# EAGLE design ELN-P Shield (EAGLE 5.06)
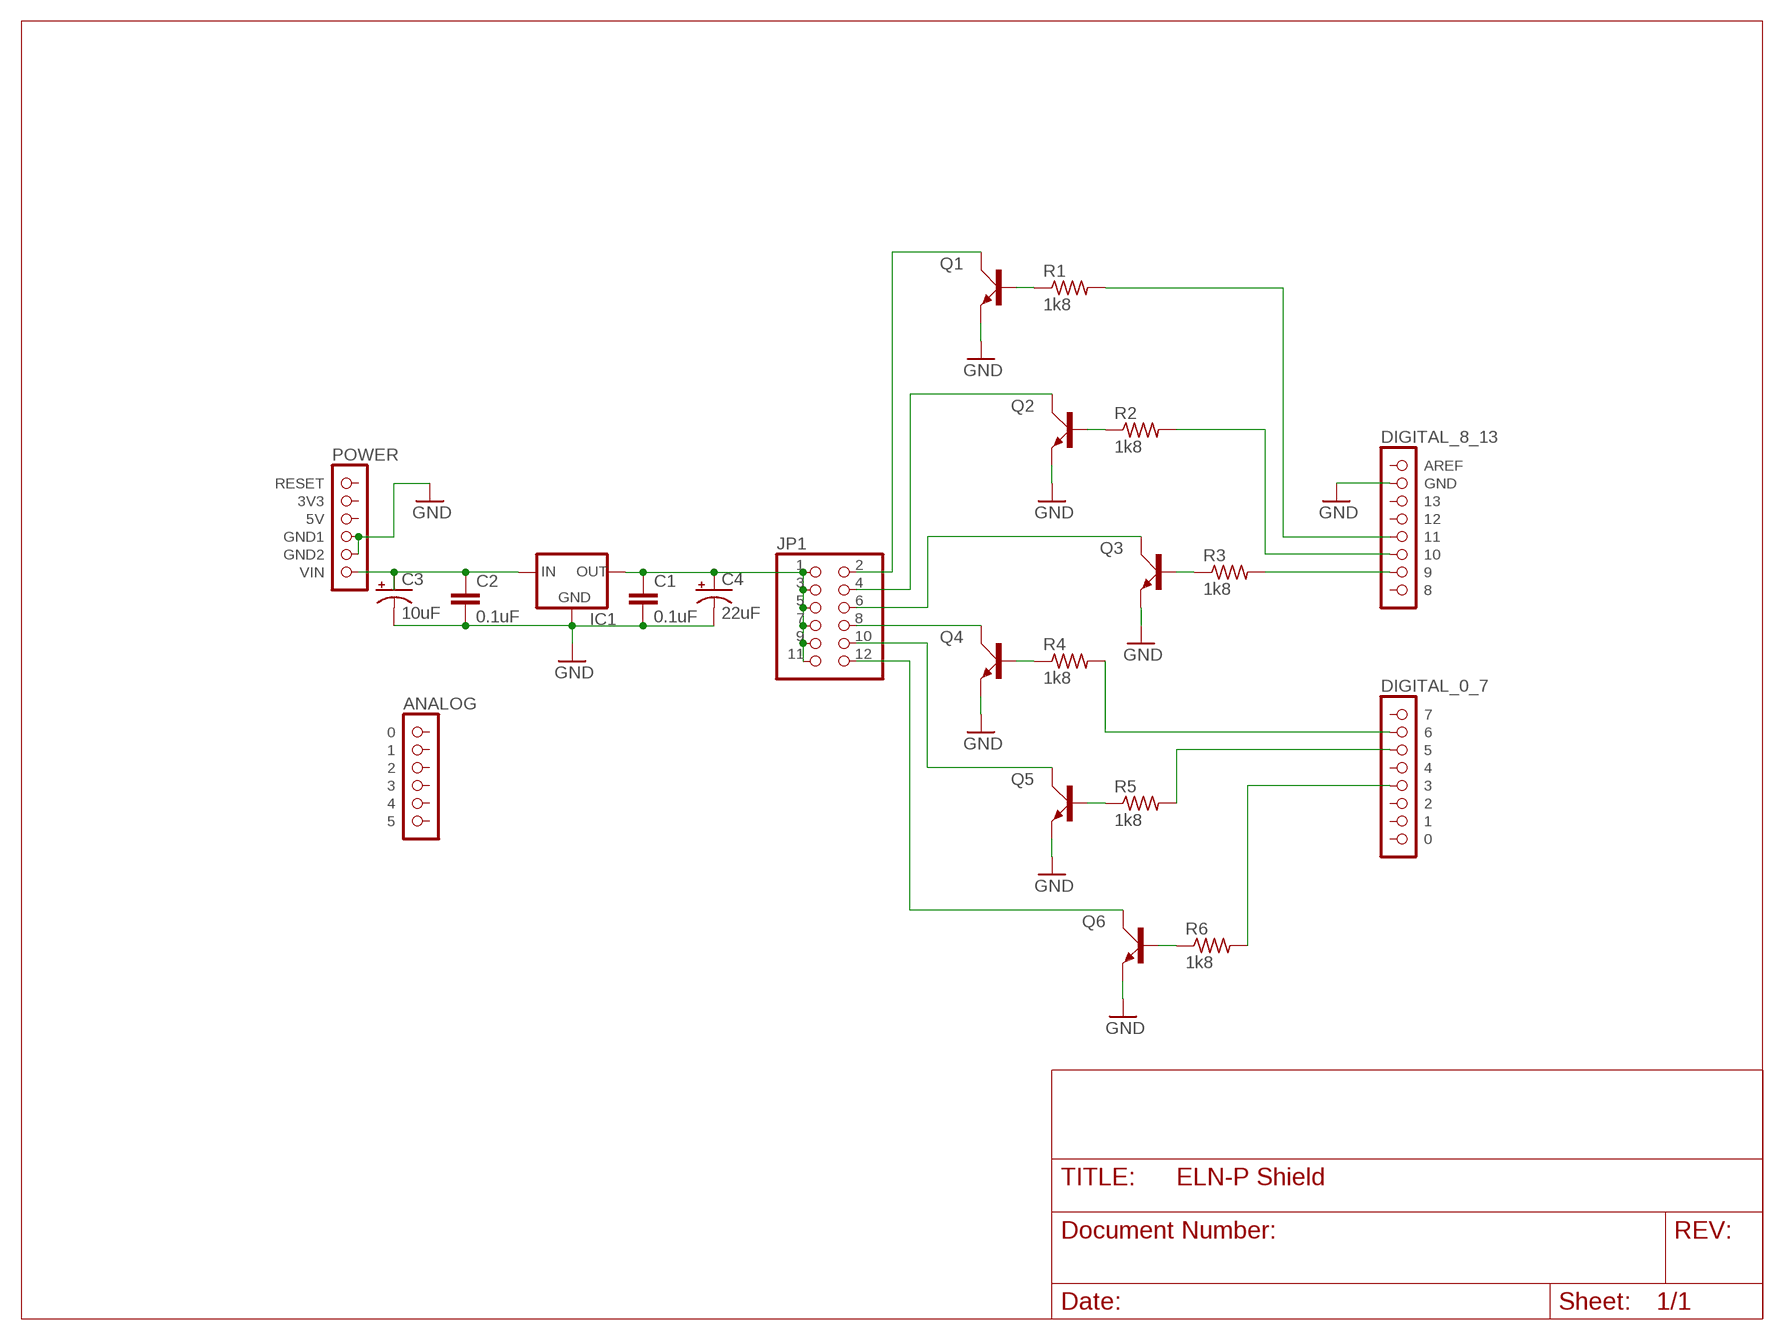
[diagram p0: schematic, sheet 1]

## Parts
C1  0.1uF  CAP1206  [C1206]
C2  0.1uF  CAP1206  [C1206]
C3  10uF  CAP_POL5MM  [NICHICON5]
C4  22uF  CAP_POL6.3MM  [NICHICON6.3]
IC1  L4940  [D2PAK_ST]
JP1  PINHD-2X6  [2X06]
Q1  BC846SOT23  [SOT23]
Q2  BC846SOT23  [SOT23]
Q3  BC846SOT23  [SOT23]
Q4  BC846SOT23  [SOT23]
Q5  BC846SOT23  [SOT23]
Q6  BC846SOT23  [SOT23]
R1  1k8  R-US_R1206  [R1206]
R2  1k8  R-US_R1206  [R1206]
R3  1k8  R-US_R1206  [R1206]
R4  1k8  R-US_R1206  [R1206]
R5  1k8  R-US_R1206  [R1206]
R6  1k8  R-US_R1206  [R1206]
U$1  POWER  [1X06]
U$2  ANALOG  [1X06]
U$3  DIGITAL_0_7  [1X08]
U$4  DIGITAL_8_13  [1X08]

## Nets
GND [Power]: C1.2 C2.2 C3.- C4.- IC1.P$3(GND) Q1.2(E) Q2.2(E) Q3.2(E) Q4.2(E) Q5.2(E) Q6.2(E) U$1.4(GND1) U$1.5(GND2) U$4.2(GND)
N$1: Q1.1(B) R1.1
N$2: JP1.2 Q1.3(C)
N$3 [Power]: C1.1 C4.+ IC1.P$2(OUT) JP1.1 JP1.3 JP1.5 JP1.7 JP1.9 JP1.11
N$4: R1.2 U$4.5
N$5: R6.2 U$3.5
N$6: R5.2 U$3.3
N$7: R4.2 U$3.2
N$8: R3.2 U$4.7
N$9: R2.2 U$4.6
N$10: Q2.1(B) R2.1
N$11: Q3.1(B) R3.1
N$12: JP1.6 Q3.3(C)
N$13: JP1.4 Q2.3(C)
N$14: Q4.1(B) R4.1
N$15: JP1.8 Q4.3(C)
N$16: Q6.1(B) R6.1
N$17: Q5.1(B) R5.1
N$18: JP1.10 Q5.3(C)
N$19: JP1.12 Q6.3(C)
VIN [Power]: C2.1 C3.+ IC1.P$1(IN) U$1.6(VIN)
Unconnected: U$1.1(RESET) U$1.2(3V3) U$1.3(5V) U$2.1 U$2.2 U$2.3 U$2.4 U$2.5 U$2.6 U$3.1 U$3.4 U$3.6 U$3.7 U$3.8 U$4.1(AREF) U$4.3 U$4.4 U$4.8

## Library data of the parts
C1 C2 = _allyourbase:CAP: Capacitor Standard 0603 ceramic capacitor, and 0.1" leaded capacitor.
C3 C4 = _allyourbase:CAP_POL: Capacitor Polarized These are standard SMD and PTH capacitors. Normally 10uF, 47uF, and 100uF in electrolytic and tantalum varieties. Always verify the external diameter of the through hole cap, it varies with capacity, voltage, and manufacturer. The EIA devices should be standard.
IC1 = _allyourbase:L4940
JP1 = pinhead:PINHD-2X6: PIN HEADER
Q1-Q6 = _allyourbase:BC846: NPN TRANSISTOR
R1-R6 = _allyourbase:R-US_: RESISTOR, American symbol
U$1 = arduino:POWER
U$2 = arduino:ANALOG
U$3 = arduino:DIGITAL_0_7
U$4 = arduino:DIGITAL_8_13

## Net classes
0 default: width 0.305 mm, drill 0.508 mm
1 Power: width 0.406 mm, drill 0.508 mm

## Board
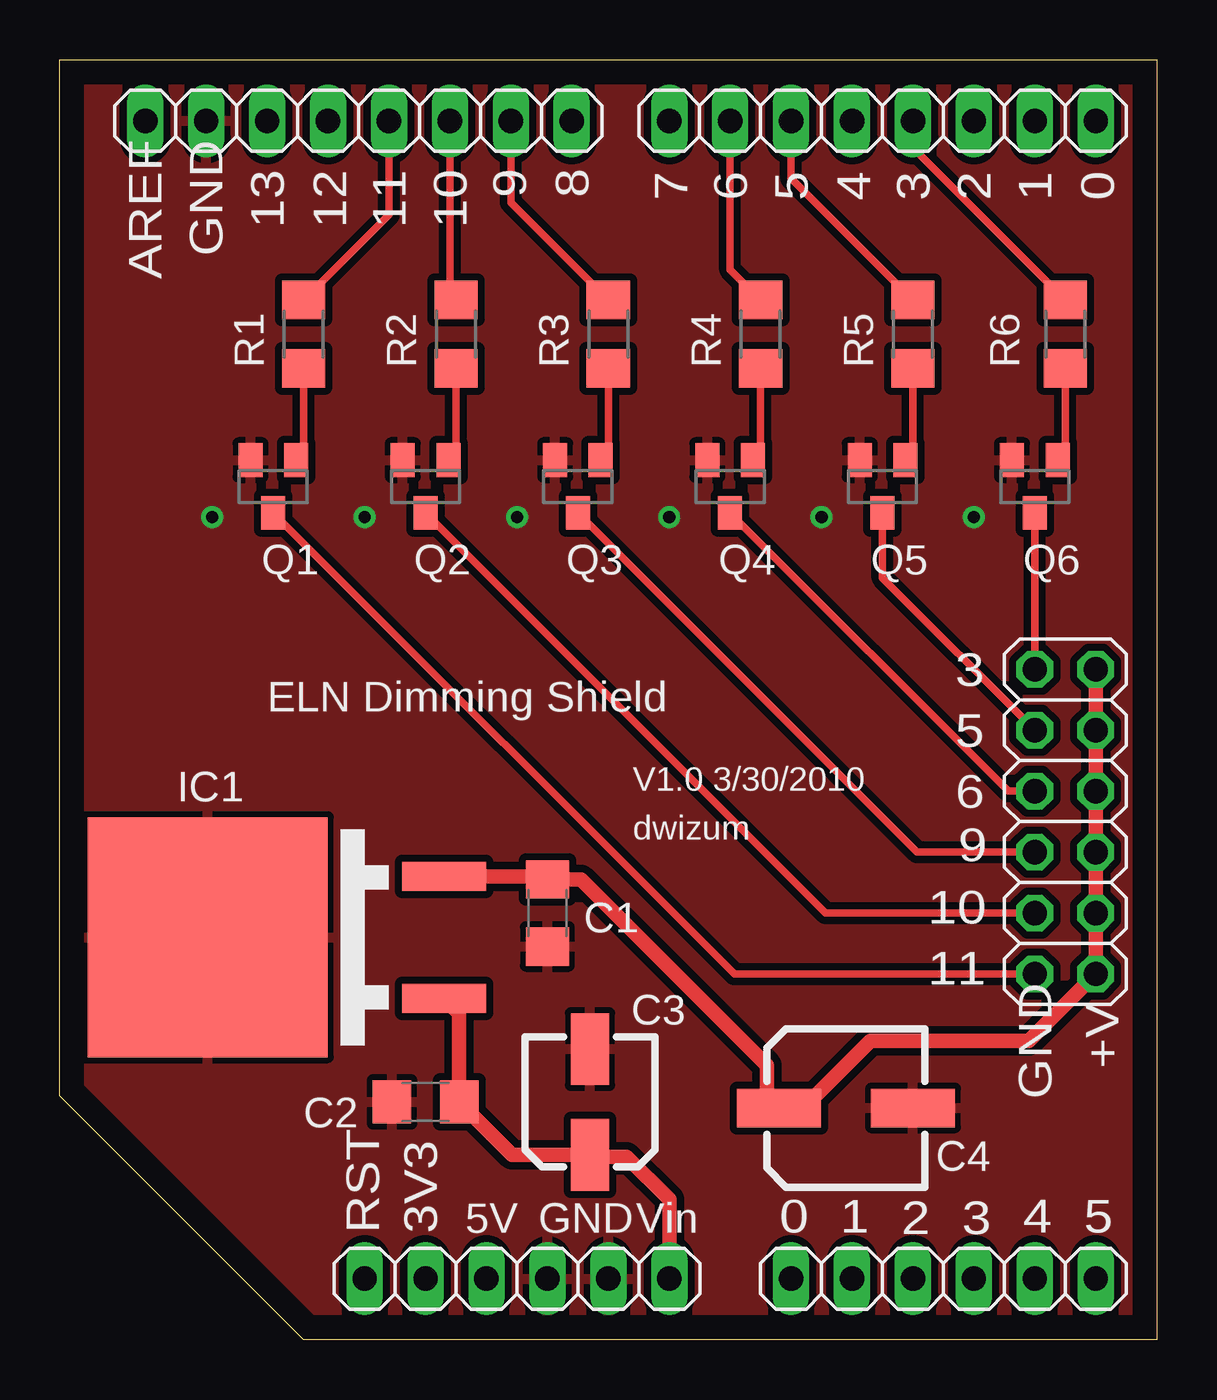
[diagram p1: board, top side]
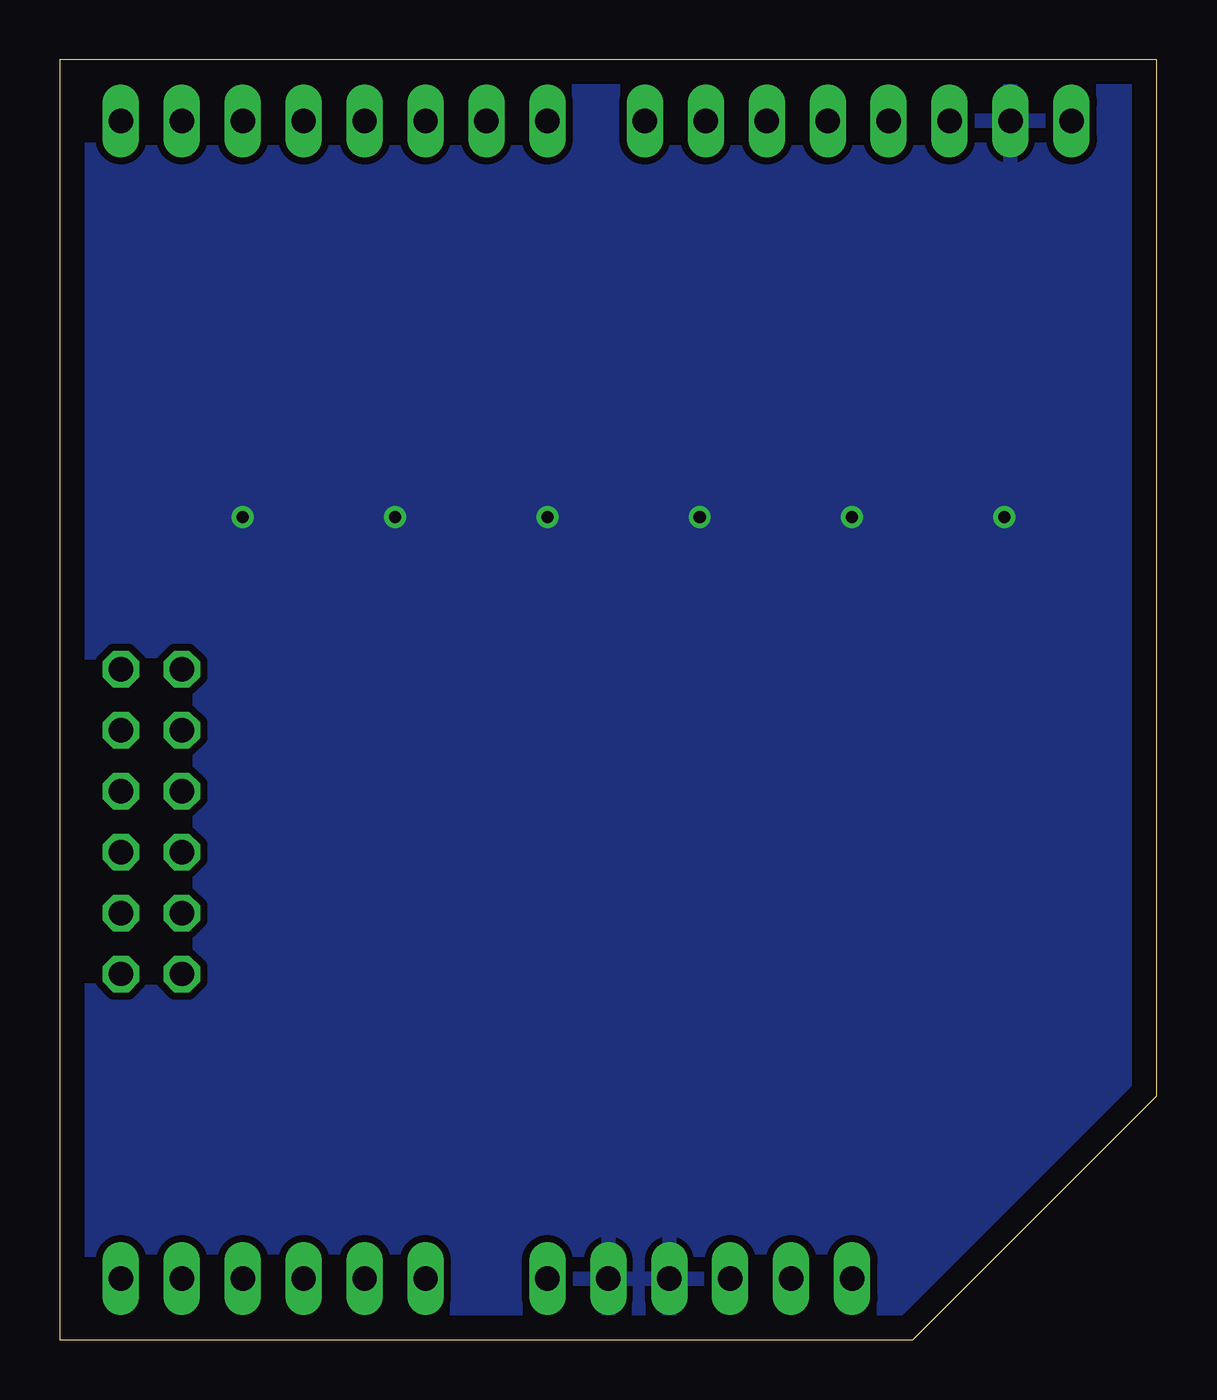
[diagram p2: board, bottom side, seen from below]

Size 45.72 x 53.34 mm. Coordinates in mm from the lower left corner, seen from the top.
Outline: 0,53.34 45.72,53.34 45.72,0 10.16,0 0,10.16 0,53.34
Copper layers (1*16): Top 0.035mm / dielectric 1.5mm / Bottom 0.035mm
Design rules "default *": minimum track width 10mil, minimum drill 20mil, track to track 8mil, track to pad 8mil, pad to pad 8mil, via to via 8mil, smd to smd 8mil, copper to edge 40mil, drill to drill 8mil, minimum pad ring 10mil, minimum via ring 8mil, stop-mask expansion 4mil, vias tented up to drill 0mil, thermal gap 10mil

### Footprints (pad centres in the part's own frame; a part is rotated, then mirrored left to right if it is on the bottom)
C1206 = smd 1.6 x 1.8: 1 -1.4,0; 2 1.4,0
NICHICON5 = smd 3 x 1.6: + 2.2,0; - -2.2,0
NICHICON6.3 = smd 3.5 x 1.6: + 2.8,0; - -2.8,0
D2PAK_ST = smd 1.2 x 3.5: P$1 -2.54,-3.31; P$2 2.54,-3.31 | smd 10 x 10: P$3 0,6.54
2X06 = drill 1.016 octagon: 1 -6.35,-1.27; 2 -6.35,1.27; 3 -3.81,-1.27; 4 -3.81,1.27; 5 -1.27,-1.27; 6 -1.27,1.27; 7 1.27,-1.27; 8 1.27,1.27; 9 3.81,-1.27; 10 3.81,1.27; 11 6.35,-1.27; 12 6.35,1.27
SOT23 = smd 1 x 1.4: 1 -0.95,-1.1; 2 0.95,-1.1; 3 0,1.1
R1206 = smd 1.6 x 1.803: 1 -1.422,0; 2 1.422,0
1X06 = drill 1.016 long: 1 -6.35,0; 2 -3.81,0; 3 -1.27,0; 4 1.27,0; 5 3.81,0; 6 6.35,0
1X08 = drill 1.016 long: 1 -8.89,0; 2 -6.35,0; 3 -3.81,0; 4 -1.27,0; 5 1.27,0; 6 3.81,0; 7 6.35,0; 8 8.89,0

### Placement (x,y rotation side)
C1  20.32,17.78 270 top
C2  15.24,9.91 180 top
C3  22.1,9.91 270 top
C4  32.77,9.65 180 top
IC1  12.7,16.76 90 top
JP1  41.91,21.59 90 top
Q1  8.89,35.56 180 top
Q2  15.24,35.56 180 top
Q3  21.59,35.56 180 top
Q4  27.94,35.56 180 top
Q5  34.29,35.56 180 top
Q6  40.64,35.56 180 top
R1  10.16,41.91 90 top
R2  16.51,41.91 90 top
R3  22.86,41.91 90 top
R4  29.21,41.91 90 top
R5  35.56,41.91 90 top
R6  41.91,41.91 90 top
U$1  19.05,2.54 0 top
U$2  36.83,2.54 0 top
U$3  34.29,50.8 0 top
U$4  12.45,50.8 0 top

### Tracks (layer width: path | path; a pad name or v marks a point on that pad's centre or on a via)
GND  (via drill 0.51)
  other vias: 6.35,34.29 12.7,34.29 19.05,34.29 25.4,34.29 31.75,34.29 38.1,34.29
  pour Top (isolate 0.305): 0,53.34 45.72,53.34 45.72,0 0,0
  pour Bottom (isolate 0.305): 0,53.34 45.72,53.34 45.72,0 0,0
N$1
  Top 0.305: R1.1 10.16,36.98 Q1.1
N$2
  Top 0.305: Q1.3 28.11,15.24 JP1.2
N$3
  Top 0.61: JP1.11 JP1.9 JP1.7 JP1.5 JP1.3 JP1.1 40.39,12.45 33.78,12.45 30.99,9.65 C4.+ 29.46,10.15 29.46,11.43 21.71,19.18 C1.1 20.2,19.3 IC1.P$2
N$4
  Top 0.305: U$4.5 13.72,46.89 R1.2
N$5
  Top 0.305: U$3.5 35.56,49.68 R6.2
N$6
  Top 0.305: U$3.3 30.48,48.41 R5.2
N$7
  Top 0.305: U$3.2 27.94,44.6 R4.2
N$8
  Top 0.305: U$4.7 18.8,47.4 R3.2
N$9
  Top 0.305: U$4.6 16.26,43.59 R2.2
N$10
  Top 0.305: R2.1 16.51,36.98 Q2.1
N$11
  Top 0.305: R3.1 22.86,36.98 Q3.1
N$12
  Top 0.305: Q3.3 35.73,20.32 JP1.6
N$13
  Top 0.305: Q2.3 31.92,17.78 JP1.4
N$14
  Top 0.305: R4.1 29.21,36.98 Q4.1
N$15
  Top 0.305: Q4.3 39.54,22.86 JP1.8
N$16
  Top 0.305: R6.1 41.91,36.98 Q6.1
N$17
  Top 0.305: R5.1 35.56,36.98 Q5.1
N$18
  Top 0.305: Q5.3 34.29,31.75 JP1.10
N$19
  Top 0.305: JP1.12 Q6.3
VIN
  Top 0.61: U$1.6 25.4,5.84 23.62,7.62 22.18,7.62 C3.+ 18.84,7.71 C2.1 16.64,13.59 IC1.P$1

### Text on the board
tPlace: ELN Dimming Shield | V1.0 3/30/2010 | dwizum
tNames: 9 | 8 | 7 | 6 | 5 | 4 | 3 | 2 | 1 | 0 | 13 | 12 | 11 | 10 | GND | AREF | 3 | 5 | 6 | 9 | 10 | 11 | +V | GND | RST | 3V3 | 5V | GND | Vin | 0 | 1 | 2 | 3 | 4 | 5